# EAGLE design esp-pinlet (EAGLE 6.5.0)
CNAME: An ESP12 breakout board with pogo pins; CREVISION: 1; DESIGNER: Johan Kanflo
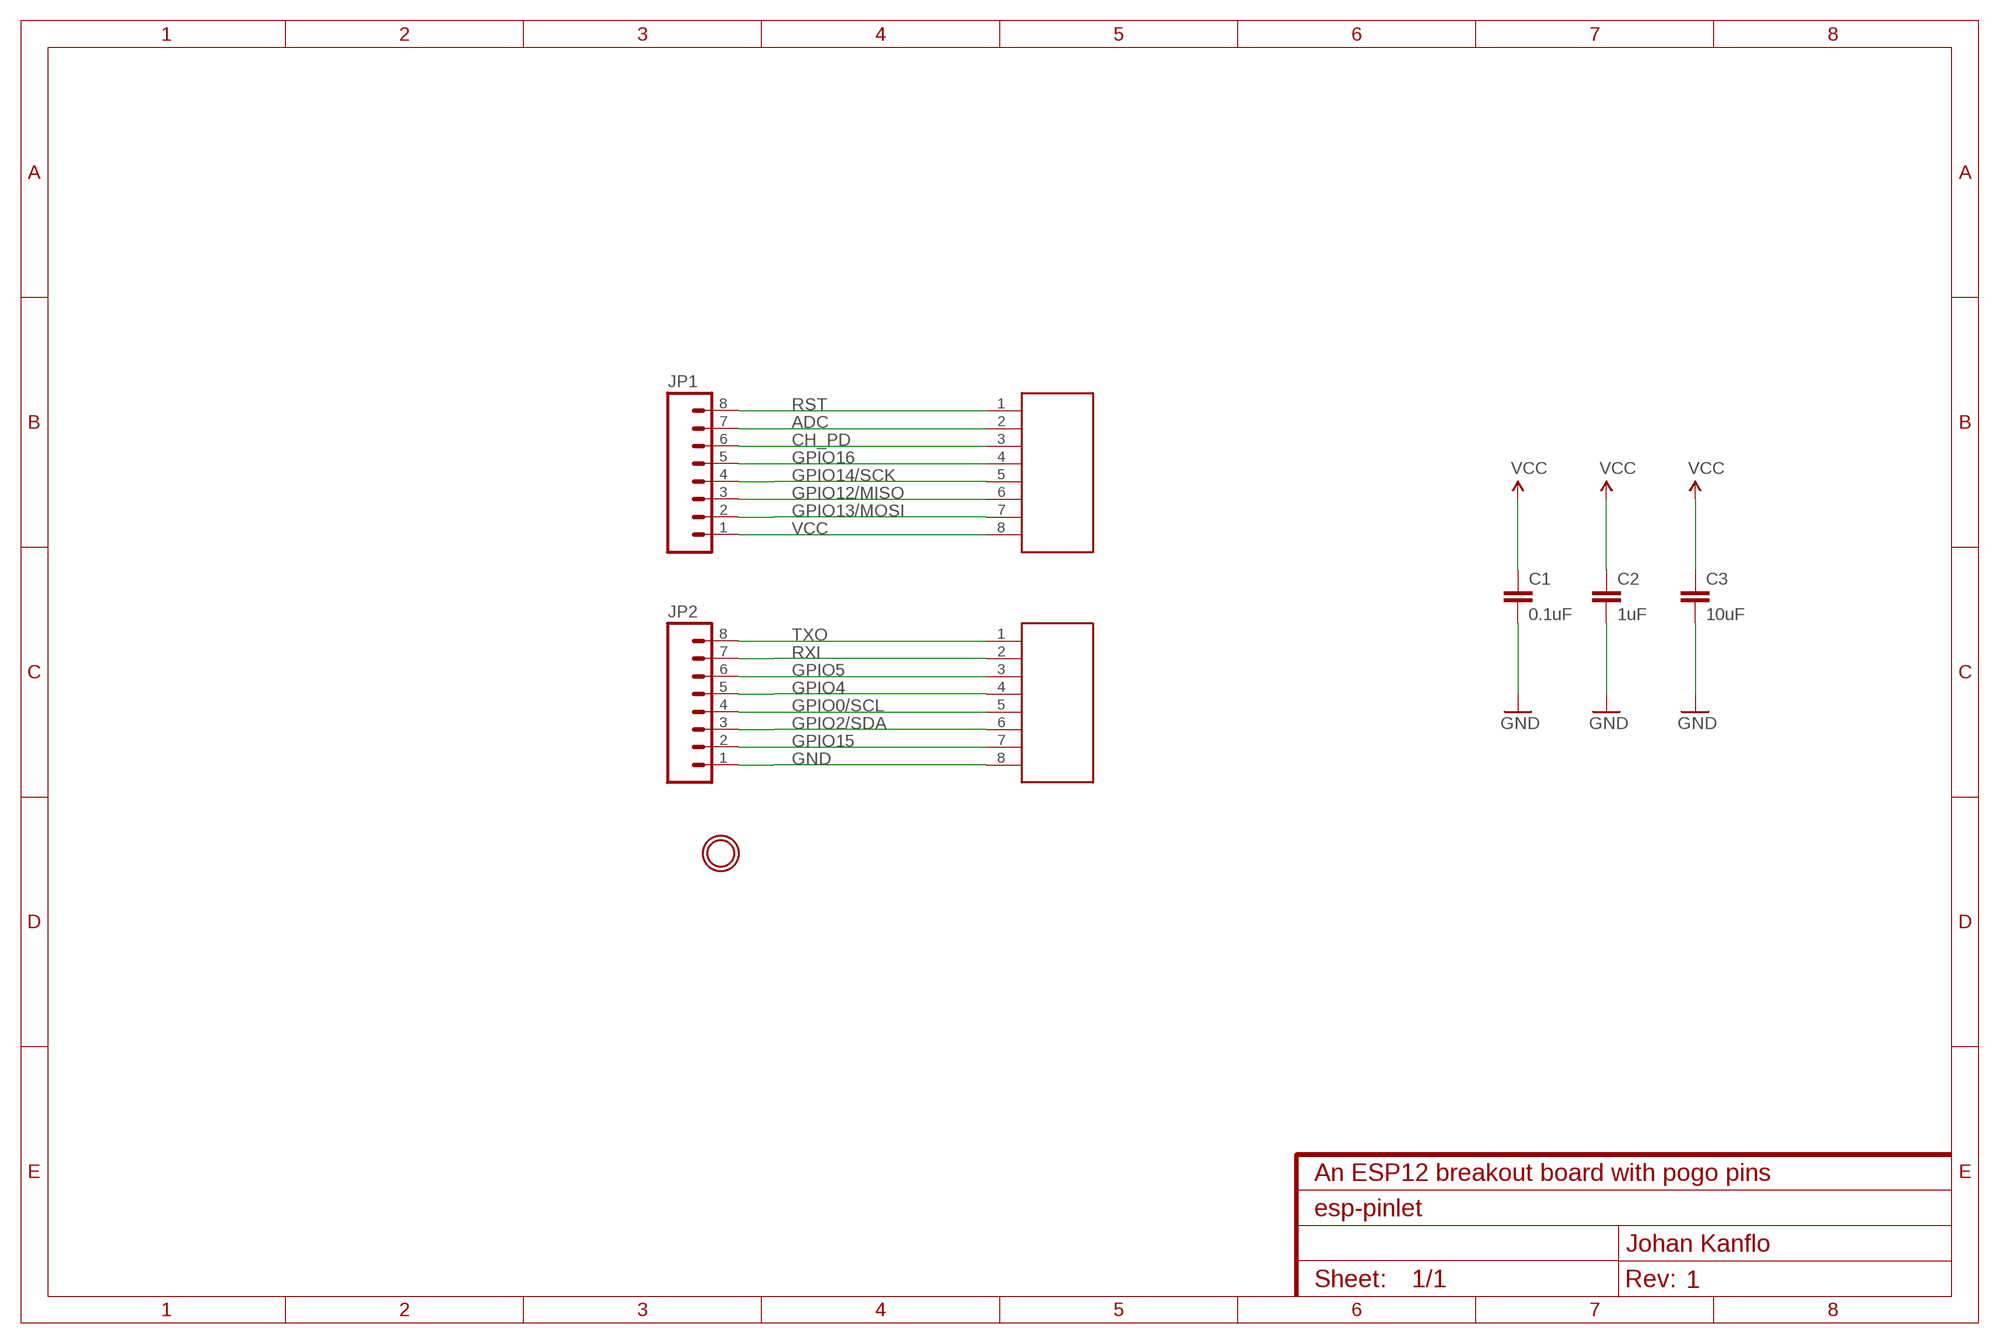
[diagram p0: schematic, sheet 1]

## Parts
C1  0.1uF  CAP0603-CAP  [0603-CAP]
C2  1uF  CAP0603-CAP  [0603-CAP]
C3  10uF  CAP0603-CAP  [0603-CAP]
JP1  M08  [1X08_ROUND]
JP2  M08  [1X08_ROUND]
U$2  82XMM_POGO_PIN  [8X2MM_POGO_PIN]
U$3  82XMM_POGO_PIN  [8X2MM_POGO_PIN]
U$6  MOUNTINGHOLE2.0  [MOUNTINGHOLE_2.0_PLATED]

## Nets
ADC: JP1.7 U$2.2
CH_PD: JP1.6 U$2.3
GND: C1.2 C2.2 C3.2 JP2.1 U$3.8
GPIO0/SCL: JP2.4 U$3.5
GPIO2/SDA: JP2.3 U$3.6
GPIO4: JP2.5 U$3.4
GPIO5: JP2.6 U$3.3
GPIO12/MISO: JP1.3 U$2.6
GPIO13/MOSI: JP1.2 U$2.7
GPIO14/SCK: JP1.4 U$2.5
GPIO15: JP2.2 U$3.7
GPIO16: JP1.5 U$2.4
RST: JP1.8 U$2.1
RXI: JP2.7 U$3.2
TXO: JP2.8 U$3.1
VCC: C1.1 C2.1 C3.1 JP1.1 U$2.8

## Library data of the parts
C1-C3 = SparkFun-Capacitors:CAP: Capacitor Standard 0603 ceramic capacitor, and 0.1" leaded capacitor.
JP1 JP2 = SparkFun-Connectors:M08: Header 8 Standard 8-pin 0.1" header. Use with straight break away headers (SKU : PRT-00116), right angle break away headers (PRT-00553), swiss pins (PRT-00743), machine pins (PRT-00117), and female headers (PRT-00115).
U$2 U$3 = kanflo:82XMM_POGO_PIN: 8x 1.02mm pogo pins P75-B1 Dia 1.02mm 100g Spring Test Probe Pogo Pin found on eBay.
U$6 = microbuilder:MOUNTINGHOLE: Mounting Hole For #2 screws (0.086"/2.18mm width, 0.094"/2.4mm hole) use 2.5mm

## Board
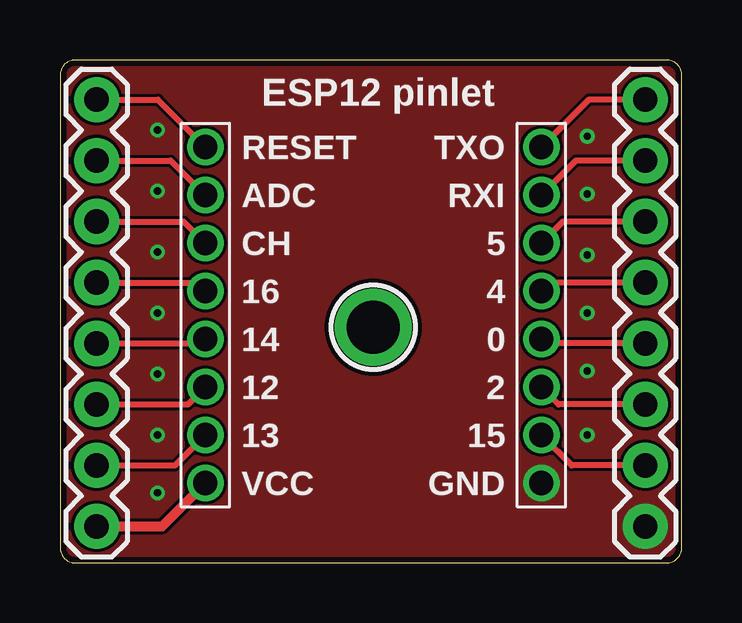
[diagram p1: board, top side]
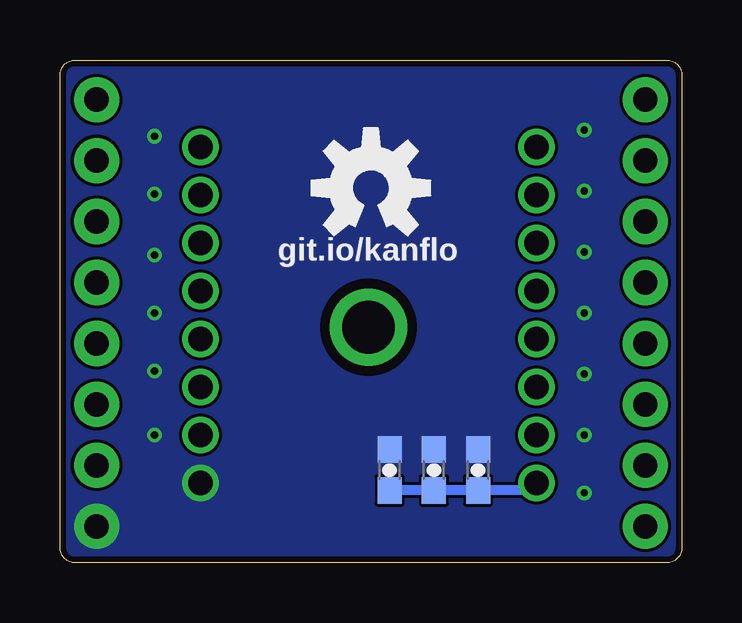
[diagram p2: board, bottom side, seen from below]

Size 25.91 x 20.95 mm. Coordinates in mm from the lower left corner, seen from the top.
Outline: 0,20.32 0,0.63 arc90 0.63,0 25.27,0 arc90 25.91,0.63 25.91,20.32 arc90 25.27,20.95 0.63,20.95 arc90 0,20.32
Copper layers (1*16): Top 0.035mm / dielectric 1.5mm / Bottom 0.035mm
Design rules "dirt_cheap_dirty_boards.v1": minimum track width 5mil, minimum drill 12mil, track to track 5mil, track to pad 5mil, pad to pad 5mil, via to via 5mil, smd to smd 0mil, copper to edge 10mil, drill to drill 10mil, minimum pad ring 10mil, minimum via ring 6mil, stop-mask expansion 2mil, vias tented up to drill 25mil, thermal gap 10mil

### Footprints (pad centres in the part's own frame; a part is rotated, then mirrored left to right if it is on the bottom)
0603-CAP = smd 1.1 x 1: 1 -0.85,0; 2 0.85,0
1X08_ROUND = drill 1.016 pad 1.88: 1 0,0; 2 2.54,0; 3 5.08,0; 4 7.62,0; 5 10.16,0; 6 12.7,0; 7 15.24,0; 8 17.78,0
8X2MM_POGO_PIN = drill 1.016 pad 1.422: 1 0,8; 2 0,6; 3 0,4; 4 0,2; 5 0,0; 6 0,-2; 7 0,-4; 8 0,-6
MOUNTINGHOLE_2.0_PLATED = drill 2.2 pad 3: P$1 0,0

### Placement (x,y rotation side)
C1  8.49,3.87 90 bottom
C2  10.33,3.87 90 bottom
C3  12.17,3.87 90 bottom
JP1  1.52,1.52 90 top
JP2  24.38,1.52 90 top
U$1  [OSHW-LOGO-M]  12.95,15.62 0 bottom
U$2  6.05,9.32 0 top
U$3  20.05,9.32 0 top
U$6  13.05,9.82 0 top

### Tracks (layer width: path | path; a pad name or v marks a point on that pad's centre or on a via)
ADC
  Top 0.254: JP1.7 4.61,16.76 U$2.2
CH_PD
  Top 0.254: JP1.6 5.15,14.22 U$2.3
GND  (via drill 0.3 pad 0.25)
  other vias: 4.06,18.03 4.06,15.49 4.06,12.95 4.06,10.41 4.06,7.87 4.06,5.33 4.06,2.92 21.97,15.37 21.97,17.78 21.97,12.83 21.97,10.41 21.97,8 21.97,5.33
  pour Bottom (rank 6, no thermals): 0,20.95 25.91,20.95 25.91,0 0,0
  pour Top (rank 6, no thermals): 0,20.95 25.91,20.95 25.91,0 0,0
GPIO0/SCL
  Top 0.254: JP2.4 20.23,9.14 U$3.5
GPIO2/SDA
  Top 0.254: JP2.3 20.77,6.6 U$3.6
GPIO4
  Top 0.254: JP2.5 20.41,11.68 U$3.4
GPIO5
  Top 0.254: JP2.6 20.95,14.22 U$3.3
GPIO12/MISO
  Top 0.254: JP1.3 5.33,6.6 U$2.6
GPIO13/MOSI
  Top 0.254: JP1.2 4.79,4.06 U$2.7
GPIO14/SCK
  Top 0.254: JP1.4 5.87,9.14 U$2.5
GPIO15
  Top 0.254: JP2.2 21.31,4.06 U$3.7
GPIO16
  Top 0.254: JP1.5 5.69,11.68 U$2.4
RST
  Top 0.254: JP1.8 4.07,19.3 U$2.1
RXI
  Top 0.254: JP2.7 21.49,16.76 U$3.2
TXO
  Top 0.254: JP2.8 22.03,19.3 U$3.1
VCC
  Top 0.406: JP1.1 4.25,1.52 U$2.8
  Bottom 0.406: U$2.8 6.36,3.02 C1.1 C2.1 C3.1

### Text on the board
tNames: ESP12 pinlet | RESET | TXO | ADC | RXI | CH | 5 | 16 | 4 | 14 | 0 | 12 | 2 | 13 | 15 | VCC | GND
bNames: git.io/kanflo